# Altium schematic sheet schBeagleBone.SchDoc
size A4
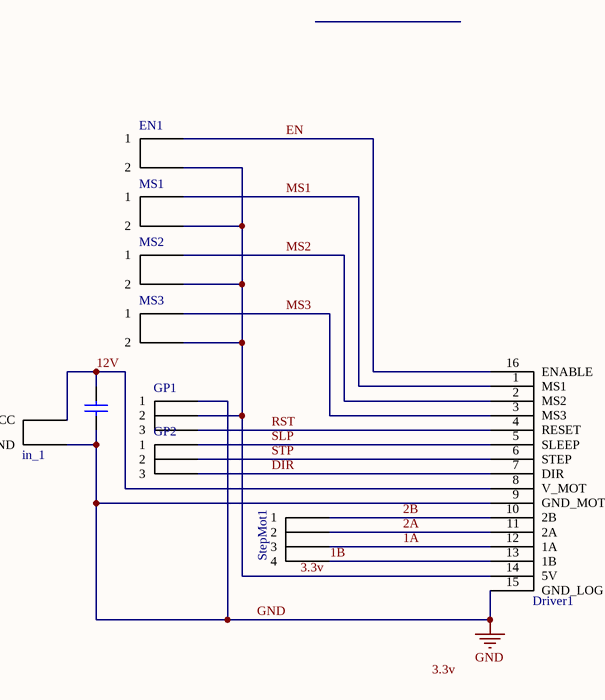
[diagram p0: schBeagleBone.SchDoc]

## Parts
C1  Cap  [RAD-0.3]  (value not drawn)
Driver1  A4988  [A4988]  (value not drawn)
EN1  KK2  [2-vias]  (value not drawn)
GP1  KK3  [3-vias]  (value not drawn)
GP2  KK3  [3-vias]  (value not drawn)
in_1  Jack  [JACK J4]  (value not drawn)
MS1  KK2  [2-vias]  (value not drawn)
MS2  KK2  [2-vias]  (value not drawn)
MS3  KK2  [2-vias]  (value not drawn)
StepMot1  KK4  [4-vias]  (value not drawn)

## Nets
GND: C1.1 Driver1.9(GND_MOT) Driver1.15(GND_LOG) GP1.1 in_1.2(GND)
1A: Driver1.12(1A) StepMot1.3
1B: Driver1.13(1B) StepMot1.4
2A: Driver1.11(2A) StepMot1.2
2B: Driver1.10(2B) StepMot1.1
3.3v: Driver1.14(5V) EN1.2 GP1.2 MS1.2 MS2.2 MS3.2
12V: C1.2 Driver1.8(V_MOT) in_1.1(VCC)
DIR: Driver1.7(DIR) GP2.3
EN: Driver1.16(ENABLE) EN1.1
MS1: Driver1.1(MS1) MS1.1
MS2: Driver1.2(MS2) MS2.1
MS3: Driver1.3(MS3) MS3.1
RST: Driver1.4(RESET) GP1.3
SLP: Driver1.5(SLEEP) GP2.1
STP: Driver1.6(STEP) GP2.2

## Notes on the sheet
- Labels drawn without touching a wire or pin: 3.3v

## Library data of the parts
C1 = Cap: Capacitor; Value: 100pF; Published: 8-Jun-2000; LatestRevisionDate: 17-Jul-2002; LatestRevisionNote: Re-released for DXP Platform.; PackageReference: RAD-0.3; Publisher: Altium Limited; PackageDescription: Radial Cap, Thru-Hole; 2 Leads; 0.3 in Pin Spacing
EN1 MS1-MS3 = KK2Vias
GP1 GP2 = KK3Vias
StepMot1 = KK4Vias: ComponentLink1Description: Fabricante; ComponentLink1URL: https://www.molex.com/molex/products/family?key=kk_254_rpc_connector_system&channel=products&chanName=family&pageTitle=Introduction&parentKey=kk_interconnect_solutions